# EAGLE design Adafruit BNO055 (EAGLE 6.6.0)
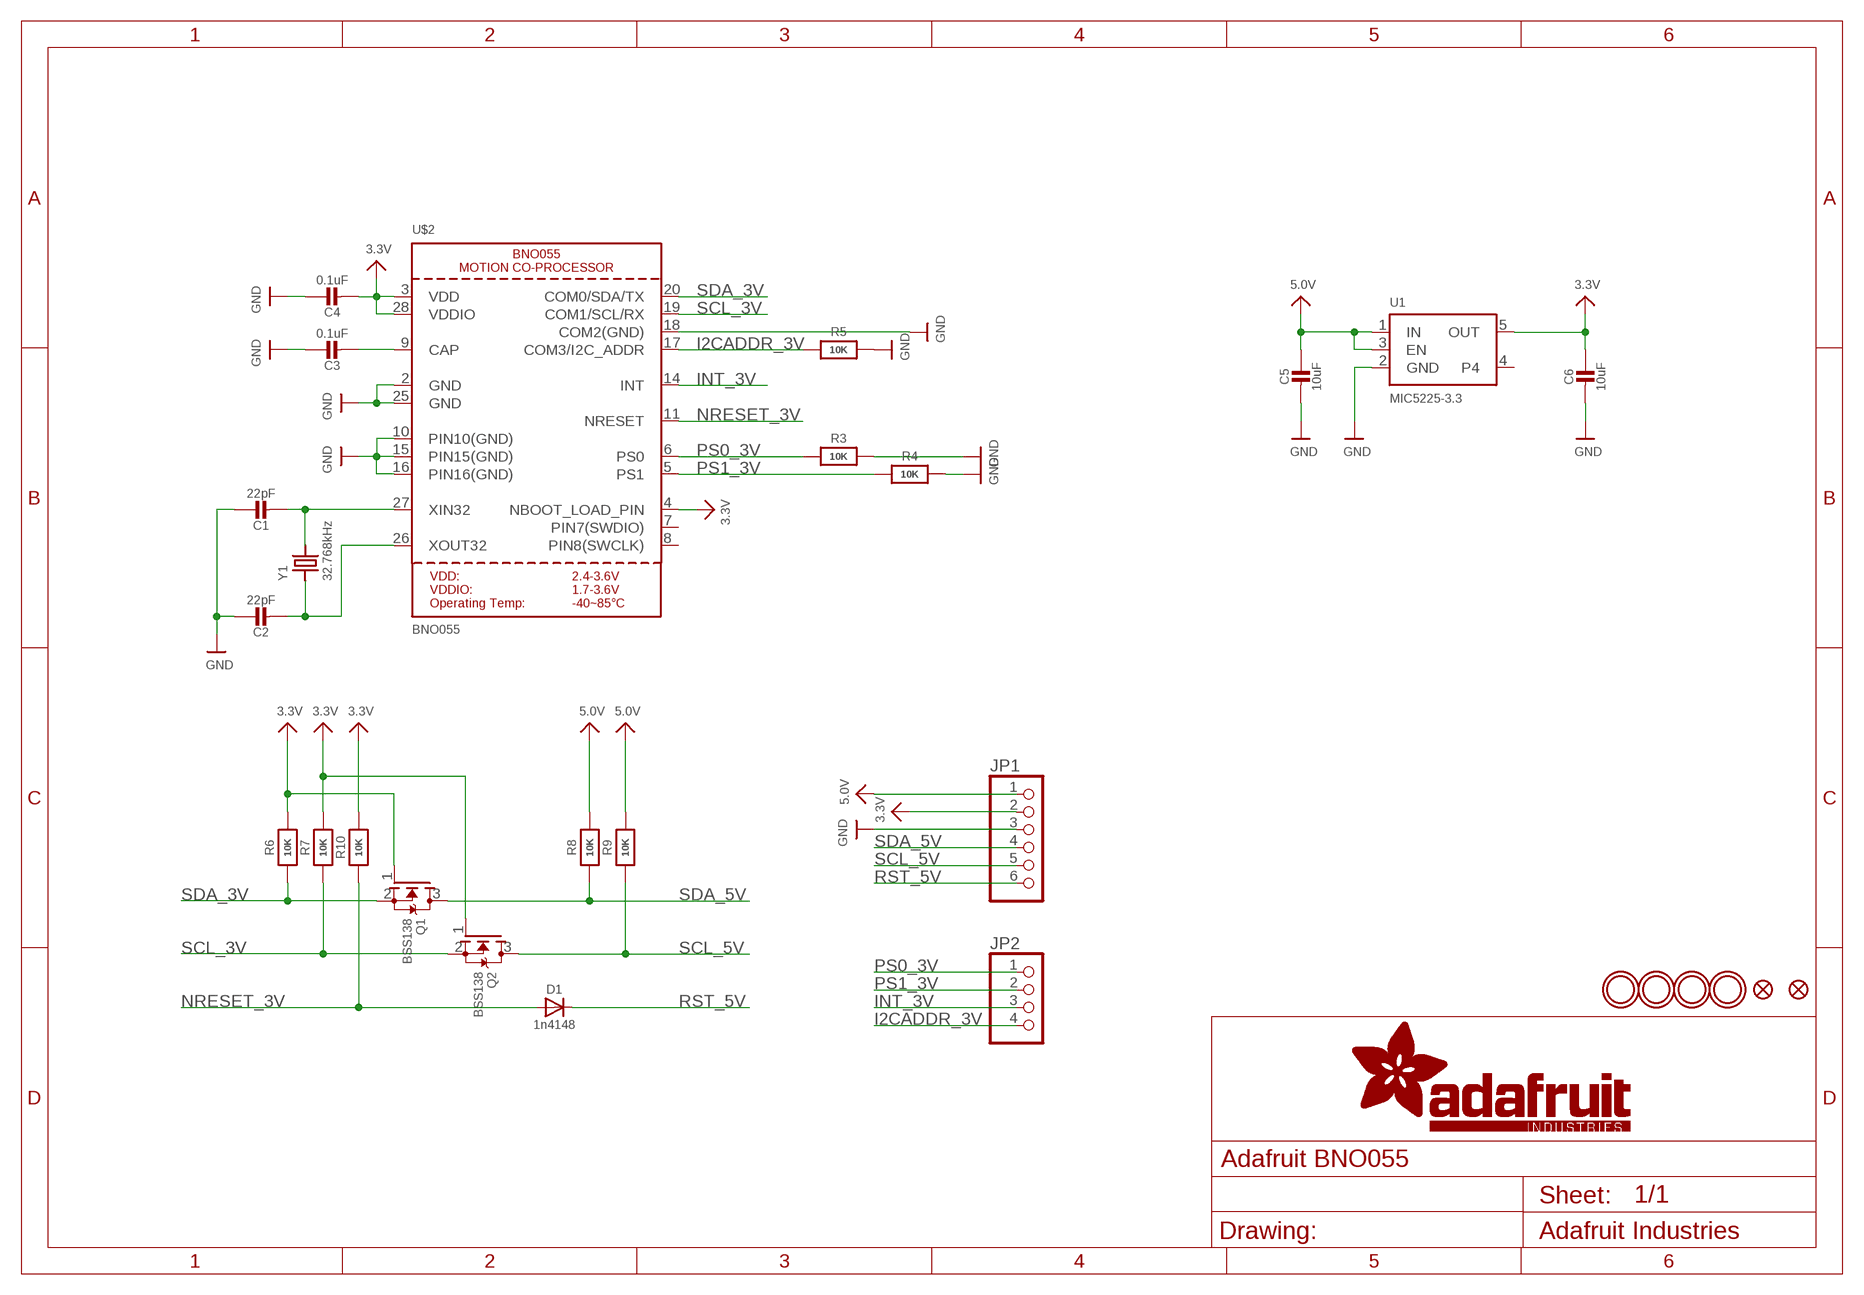
[diagram p0: schematic, sheet 1]

## Parts
C1  22pF  CAP_CERAMIC0805-NOOUTLINE  [0805-NO]
C2  22pF  CAP_CERAMIC0805-NOOUTLINE  [0805-NO]
C3  0.1uF  CAP_CERAMIC0805-NOOUTLINE  [0805-NO]
C4  0.1uF  CAP_CERAMIC0805_10MGAP  [0805_10MGAP]
C5  10uF  CAP_CERAMIC0805-NOOUTLINE  [0805-NO]
C6  10uF  CAP_CERAMIC0805_10MGAP  [0805_10MGAP]
D1  1n4148  DIODESOD-323  [SOD-323]
FID1  FIDUCIAL""  [FIDUCIAL_1MM]
FID2  FIDUCIAL""  [FIDUCIAL_1MM]
JP1  HEADER-1X676MIL  [1X06_ROUND_76]
JP2  HEADER-1X476MIL  [1X04_ROUND_76]
Q1  BSS138  MOSFET-NWIDE  [SOT23-WIDE]
Q2  BSS138  MOSFET-NWIDE  [SOT23-WIDE]
R3  10K  RESISTOR0805_NOOUTLINE  [0805-NO]
R4  10K  RESISTOR0805_NOOUTLINE  [0805-NO]
R5  10K  RESISTOR0805_NOOUTLINE  [0805-NO]
R6  10K  RESISTOR0805_NOOUTLINE  [0805-NO]
R7  10K  RESISTOR0805_NOOUTLINE  [0805-NO]
R8  10K  RESISTOR_0805MP  [_0805MP]
R9  10K  RESISTOR_0805MP  [_0805MP]
R10  10K  RESISTOR0805_NOOUTLINE  [0805-NO]
U1  MIC5225-3.3  VREG_SOT23-5  [SOT23-5]
U$2  BNO055  [BNO055]
U$29  MOUNTINGHOLE2.5_THICK  [MOUNTINGHOLE_2.5_PLATED_THICK]
U$30  MOUNTINGHOLE2.5_THICK  [MOUNTINGHOLE_2.5_PLATED_THICK]
U$31  MOUNTINGHOLE2.5_THICK  [MOUNTINGHOLE_2.5_PLATED_THICK]
U$32  MOUNTINGHOLE2.5_THICK  [MOUNTINGHOLE_2.5_PLATED_THICK]
Y1  32.768kHz  CRYSTAL8.0X3.8  [CRYSTAL_8X3.8]

## Nets
3.3V: C4.2 C6.1 JP1.2 Q1.1(G) Q2.1(G) R6.2 R7.2 R10.2 U1.5(OUT) U$2.3(VDD) U$2.4(NBOOT_LOAD_PIN) U$2.28(VDDIO)
5.0V: C5.1 JP1.1 R8.2 R9.2 U1.1(IN) U1.3(EN)
GND: C1.1 C2.1 C3.1 C4.1 C5.2 C6.2 JP1.3 R3.2 R4.2 R5.2 U1.2(GND) U$2.2(GND) U$2.10(PIN10(GND)) U$2.15(PIN15(GND)) U$2.16(PIN16(GND)) U$2.18(COM2(GND)) U$2.25(GND)
I2CADDR_3V: JP2.4 R5.1 U$2.17(COM3/I2C_ADDR)
INT_3V: JP2.3 U$2.14(INT)
N$1: C1.2 U$2.27(XIN32) Y1.P$4
N$2: C2.2 U$2.26(XOUT32) Y1.P$1
N$3: C3.2 U$2.9(CAP)
NRESET_3V: D1.A R10.1 U$2.11(NRESET)
PS0_3V: JP2.1 R3.1 U$2.6(PS0)
PS1_3V: JP2.2 R4.1 U$2.5(PS1)
RST_5V: D1.C JP1.6
SCL_3V: Q2.2(S) R7.1 U$2.19(COM1/SCL/RX)
SCL_5V: JP1.5 Q2.3(D) R9.1
SDA_3V: Q1.2(S) R6.1 U$2.20(COM0/SDA/TX)
SDA_5V: JP1.4 Q1.3(D) R8.1
Unconnected: U1.4 U$2.7(PIN7(SWDIO)) U$2.8(PIN8(SWCLK))

## Library data of the parts
C1-C6 = microbuilder:CAP_CERAMIC: Ceramic Capacitors For new designs, use the packages preceded by an '_' character since they are more reliable: The following footprints should be used on most boards: _0402 - Standard footprint for regular board layouts _0603 - Standard footprint for regular board layouts _0805 - Standard footprint for regular board layouts _1206 - Standard footprint for regular board layouts For extremely tight-pitch boards where space is at a premium, the following 'micro-pitch' footprints can be used (smaller pads, no silkscreen outline, etc.): _0402MP - Micro-pitch footprint for very dense/compact boards _0603MP - Micro-pitch footprint for very dense/compact boards _0805MP - Micro-pitch footprint for very dense/compact boards _1206MP - Micro-pitch footprint for very dense/compact boards
D1 = microbuilder:DIODE: Diode SMA Model Volts Amps Type Vf Ir Digikey # Notes SSA34-E3 40V 3A Schottky 480mV @ 3A 200uA @ 40V SSA34-E3/61TGITR-ND CDBA120-G 20V 1A Schottky 500mV @ 1A 500uA @ 20V 641-1014-6-ND REEL MBRA210 10V 2A Schottky 350mV @ 2A 700uA @ 10V MBRA210LT3 SOD-123 Model Volts Amps Type Vf Ir Order # Notes BAT54T1G 30V 200mA Schottky 800mV @ 200mA 2uA @ 25V BAT54T1GOSTR-ND B0530W 30V 500mA Schottky 430mV @ 500mA 130uA @ 30V B0530W-FDICT-ND REEL MBR120 20V 1A Schottky 340mV @ 1A MBR120VLSFT1GOSCT-ND SOD-323 Model Volts Amps Type Vf Ir Order # Notes PMEG2005EJ 20V 500mA Schottky 355mV @ 500mA 568-4110-1-ND ZLLS410 10V 570mA Schottky 380mV @ 570mA ZLLS410CT-ND 1N4148WS 75V 150mA Silicon/Simple 1V 1N4148WSFSCT-ND REEL SOD-523 Model Volts Amps Type Vf Ir Order # Notes BAT54XV2 30V 200mA Schottky 0.8V @ 100mA BAT54XV2CT-ND TB751S 30V 30mA Schottky RB751S-40TE61CT-ND SOT23-R/W (R = Solder Paste/Reflow Ovens, W = Hand-Soldering) Model Volts Amps Type Vf Ir Order # Notes BAT54FILM 40V 300mA Schottky 497-7162-1-ND POWERDI-5 Model Volts Amps Type Vf Ir Order # Notes PDS560 60V 5A Schottky 670mV @ 5A 150uA @ 60V PDS560DICT-ND
FID1 FID2 = microbuilder:FIDUCIAL: Fiducial Alignment Points Various fiducial points for machine vision alignment.; BOM: EXCLUDE
JP1 = microbuilder:HEADER-1X6: PIN HEADER
JP2 = microbuilder:HEADER-1X4: PIN HEADER
Q1 Q2 = microbuilder:MOSFET-N: N-Channel Mosfet LEGEND VDS: Voltage Drain-Source ID: Drain Current RDS(ON): Drain-Source On-State Resistance VGS(TH): Gate-Source Threshold Voltage CISS: Drain-Source Input Capacitance SOT-23 Name VDS ID RDS(ON) VGS(TH) CISS Order Number 2N7002E 60V 260mA 2.5 Ohm 2.5V @ 250uA 26.7pF @ 25V 2N7002ET1GOSTR-ND BSH103 30V 850mA 400 mOhm 400mV @ 1mA 83pF @ 24V BSH103,235-ND BSS138 60V 320mA 1.6 Ohm 1.5V @ 250uA 50pF @ 10V Mouser: 771-BSS138PW115 DMN2075U-7 20V 4.2A 38 mOhm 1V @ 250 uA 594.3pF @ 10V DMN2075U-7DICT-ND * BSS138 good choice for I2C level-shifting POWERPAK 1212-8 Name VDS ID RDS(ON) VGS(TH) CISS Order Number Si7308DN 60V 6A 58 mOhm 3V @ 250uA 665pF @ 15V SI7308DN-T1-E3CT-ND
R3-R10 = microbuilder:RESISTOR: Resistors For new designs, use the packages preceded by an '_' character since they are more reliable: The following footprints should be used on most boards: _0402 - Standard footprint for regular board layouts _0603 - Standard footprint for regular board layouts _0805 - Standard footprint for regular board layouts _1206 - Standard footprint for regular board layouts For extremely tight-pitch boards where space is at a premium, the following 'micro-pitch' footprints can be used (smaller pads, no silkscreen outline, etc.): _0402MP - Micro-pitch footprint for very dense/compact boards _0603MP - Micro-pitch footprint for very dense/compact boards _0805MP - Micro-pitch footprint for very dense/compact boards _1206MP - Micro-pitch footprint for very dense/compact boards
U1 = microbuilder:VREG_SOT23-5: SOT23-5 Fixed Voltage Regulators Part Current Out V Out V In V Dropout θJA (°C/W) TJ (°C) Digikey Part No. ADP121 150mA 3.3V 3.4-5.5V 0.09V @ 150mA -- -- ADP121-AUJZ33R7CT-ND ADP121 150mA 3.0V 3.1-5.5V 0.09V @ 150mA -- -- ADP121-AUJZ30R7CT-ND ADP122 300mA 3.3V 3.4-5.5V 0.085V @ 300mA -- -- ADP122AUJZ-3.3-R7CT-ND ADP1712 300mA 3.3V 3.5-5.5V 0.17V @ 300mA -- -- ADP1712AUJZ-3.3-R7TR-ND AP7311 (Low Cost) 150mA 3.3V 3.5-6V 0.15V @ 150mA -- -- AP7311-33WG-7DICT-ND LD39015M18R 150mA 1.8V 1.9V-5.5V 0.08V @ 100mA -- -- 497-6977-1-ND LP2985A-33DBVR 150mA 3.3V 3.3-16V 0.28V @ 150mA 206 150 296-18479-1-ND MCP1824T-3302E/OT 300mA 3.3V 3.5V-6V 0.2V @ 300mA -- -- MCP1824T-3302E/OTCT-ND MIC5205-2.5YM5 TR 150mA 2.5V 2.7-16V 0.165V @ 150mA -- -- 576-1257-2-ND MIC5205-3.0YM5 TR 150mA 3.0V 3.2V-16V 0.165V @ 150mA -- -- 576-1258-2-ND MIC5205-3.3YM5 TR 150mA 3.3V 3.5V-16V 0.165V @ 150mA -- -- 576-1259-2-ND TPS780330220 150mA 3.3V+2.2V 3.6-5.5V 250mV Max -- -- 296-23332-1-ND TDA3663/N1,135 100mA 3.3V 3.5-45V 0.18V @ 50mA -- -- 568-5343-1-ND Max operating temp can be calculated using θJA, TJ (max junction temperature), and power in watts. Set the "Maximum Ambient Temperature" until it reaches TJ ("Max Junction Temperature"), which is the absolute limit for safe use of the regulator: Heat Sink Temperature Calculator <http://www.daycounter.com/Calculators/Heat-Sink-Temperature-Calculator.phtml> For example, With 12V source into a 3.3V LP2985 and a 30mA load, we are dissipating (12V-3.3V) * 0.03A = 0.261W. With a θJA of 206 °C/W, a TJ of 150°C, and 261mW we can safely use the chip without a heat sink up to 75°C (=147.1°C Junction Temperature).
U$2 = microbuilder:BNO055: BNO055 - Motion Co-Processor
U$29-U$32 = microbuilder:MOUNTINGHOLE: Mounting Hole For #2 screws (0.086"/2.18mm width, 0.094"/2.4mm hole) use 2.5mm; BOM: EXCLUDE
Y1 = microbuilder:CRYSTAL: Crystals HC49UP - Surface Mount Crystal 4.0MHz 18pF +/-30ppm Surface Mount Crystal [Digikey: 535-9857-1-ND] 12.0 MHz Surface Mount Crystal [Digikey: 535-9869-6-ND] 25.0 MHz Surface Mount Crystal [Digikey: 535-9078-1-ND] 2.5 x 2.0mm - MEMs SMT Crystal 16.0 MHz 10pF 20ppm 2.5 x 2.0mm Crystal [Digikey -40-85°C: 535-10923-1-ND] 3.2 x 2.5mm - MEMs SMT Crystal 12.0 MHz 8pF 15ppm 3.2 x 2.5mm Crystal [Digikey: -10-70°C: 644-1047-1-ND -40-125°C: 644-1128-1-ND] 40~85°C cheaper: 644-1173-6-ND 16.0 MHz 8pF 15ppm 3.2 x 2.5mm Crystal [Digikey: -10-70°C: 644-1049-1-ND -40-125°C: 644-1129-2-ND]-40~85°C cheaper: 644-1175-6-ND 16.0 MHz 10pF 10ppm 3.2 x 2.5mm Crystal [Digikey: 644-1100-1-ND] 27.12 MHz 18pF 30ppm 3.2 x 2.5mm Crystal [Digikey: 887-1424-1-ND] 27.12MHz 10pF 10ppm 3.2 x 2.5mm Crystal [Digikey: 887-1329-1-ND] 4.9 x 1.8mm - MEMs SMT Crystal 32.768 KHz 12.5pF 20ppm 4.9 x 1.8mm Crystal [Digikey: SE2415CT-ND] 8.0 x 3.8mm - Surface Mount Crystal 32.768kHz 12.5pF 20ppm -40°C-85°C [Digikey: 535-9166-2-ND] Cylinder 32.768KHz Cylinder Crystal (2x6mm body) [Ex. Digikey: 300-8341-2-ND]

## Board
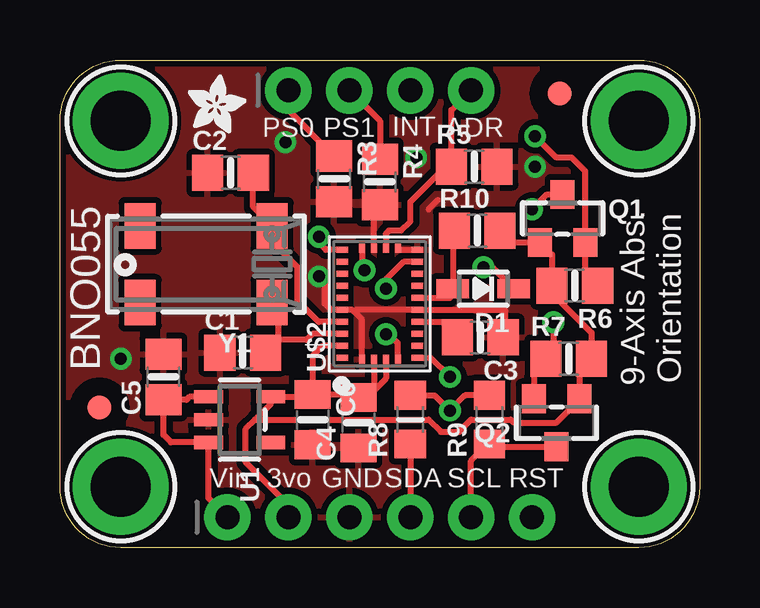
[diagram p1: board, top side]
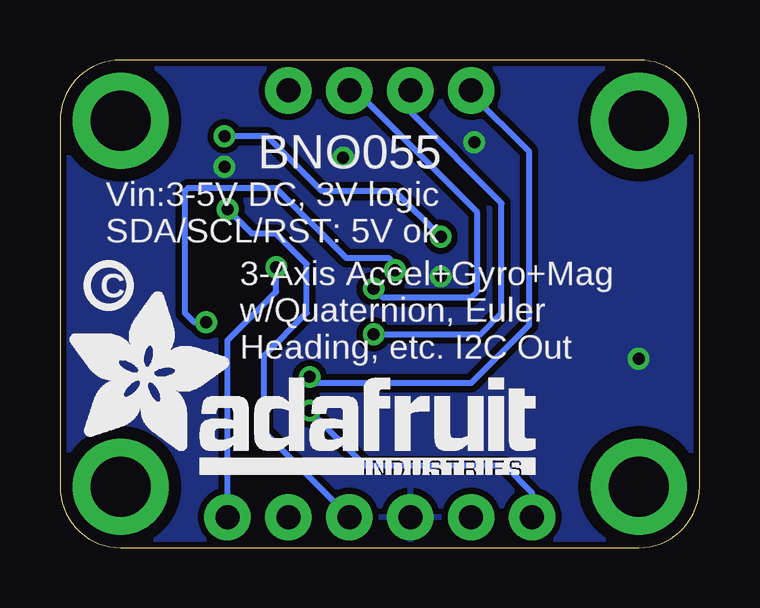
[diagram p2: board, bottom side, seen from below]

Size 26.67 x 20.32 mm. Coordinates in mm from the lower left corner, seen from the top.
Outline: 2.54,20.32 24.13,20.32 arc-90 26.67,17.78 26.67,2.54 arc-90 24.13,0 2.54,0 arc-90 0,2.54 0,17.78 arc-90 2.54,20.32
Copper layers (1*16): Top 0.035mm / dielectric 1.5mm / Bottom 0.035mm
Design rules "adafruit *": minimum track width 8mil, minimum drill 15.5mil, track to track 8mil, track to pad 8mil, pad to pad 8mil, via to via 8mil, smd to smd 8mil, copper to edge 10mil, drill to drill 8mil, minimum pad ring 10mil, minimum via ring 8mil, stop-mask expansion 2mil, vias tented up to drill 20mil, thermal gap 10mil

### Footprints (pad centres in the part's own frame; a part is rotated, then mirrored left to right if it is on the bottom)
0805-NO = smd 1.3 x 1.5: 1 -0.95,0; 2 0.95,0
0805_10MGAP = smd 1.2 x 1.5: 1 -1.05,0; 2 1.05,0
SOD-323 = smd 1.35 x 0.8: A 1.27,0; C -1.27,0
FIDUCIAL_1MM = smd 1 x 1: 1 0,0
1X06_ROUND_76 = drill 1 pad 1.93: 1 -6.35,0; 2 -3.81,0; 3 -1.27,0; 4 1.27,0; 5 3.81,0; 6 6.35,0
1X04_ROUND_76 = drill 1 pad 1.93: 1 -3.81,0; 2 -1.27,0; 3 1.27,0; 4 3.81,0
SOT23-WIDE = smd 1 x 1.2: 1 -0.95,-1; 2 0.95,-1; 3 0,1
_0805MP = smd 1.2 x 1.3: 1 -1.016,0; 2 1.016,0
SOT23-5 = smd 0.55 x 1.2: 1 -0.95,-1.3; 2 0,-1.3; 3 0.95,-1.3; 4 0.95,1.3; 5 -0.95,1.3
BNO055 = smd 0.25 x 0.475: 1 -2.25,1.562; 6 -2.25,-1.562; 7 -1.75,-1.562; 8 -1.25,-1.562; 9 -0.75,-1.562; 10 -0.25,-1.562; 11 0.25,-1.562; 12 0.75,-1.562; 13 1.25,-1.562; 14 1.75,-1.562; 15 2.25,-1.562; 20 2.25,1.562; 21 1.75,1.562; 22 1.25,1.562; 23 0.75,1.562; 24 0.25,1.562; 25 -0.25,1.562; 26 -0.75,1.562; 27 -1.25,1.562; 28 -1.75,1.562 | smd 0.375 x 0.25: 2 -2.312,0.75; 3 -2.312,0.25; 4 -2.312,-0.25; 5 -2.312,-0.75; 16 2.312,-0.75; 17 2.312,-0.25; 18 2.312,0.25; 19 2.312,0.75
MOUNTINGHOLE_2.5_PLATED_THICK = drill 2.5 pad 4: P$1 0,0
CRYSTAL_8X3.8 = smd 1.3 x 1.9: P$1 -2.75,-1.6; P$2 2.75,-1.6; P$3 2.75,1.6; P$4 -2.75,1.6

### Placement (x,y rotation side)
C1  7.62,8.13 0 top
C2  7.11,15.62 0 top
C3  17.53,8.76 180 top
C4  12.45,5.21 90 top
C5  4.32,7.11 90 top
C6  10.54,5.33 270 top
D1  17.65,10.79 180 top
FID1  20.83,18.92 0 top
FID2  1.65,5.84 0 top
JP1  13.34,1.27 0 top
JP2  13.34,19.05 0 top
Q1  20.95,13.72 0 top
Q2  20.7,5.21 180 top
R3  11.43,15.37 270 top
R4  13.34,15.24 270 top
R5  17.27,15.88 0 top
R6  21.46,10.92 180 top
R7  21.21,7.87 0 top
R8  14.61,5.33 90 top
R9  17.91,5.33 90 top
R10  17.4,13.21 0 top
U1  7.49,5.33 270 top
U$2  13.34,10.16 90 top
U$3  [PCBFEAT-REV-040]  24.64,10.92 0 bottom
U$28  [ADAFRUIT_TEXT_20MM]  26.42,3.05 0 bottom
U$29  2.54,17.78 0 top
U$30  2.54,2.54 0 top
U$31  24.13,17.78 0 top
U$32  24.13,2.54 0 top
U$33  [ADAFRUIT_2.5MM]  5.33,17.27 0 top
Y1  6.1,11.81 180 top

### Tracks (layer width: path | path; a pad name or v marks a point on that pad's centre or on a via)
3.3V
  Top 0.254: U$2.3 13.09,6.55 | U$2.4 13.59,7.05 13.09,6.55 | U$2.28 10.95,8.41 10.54,8 C6.1 | 22.03,7.75 R7.2 | JP1.2 9.53,1.78 7.75,3.56 7.75,4.95 8.13,5.33 | 8.13,5.33 8.79,6 U1.5 10.44,6.28 C6.1 | 8.13,5.33 15.37,5.33 15.88,4.83 16.64,4.83 17.14,5.33 18.8,5.33 18.92,5.21 20.7,5.21 21.65,6.16 Q2.1 21.65,7.37 R7.2 | R10.2 18.84,12.72 Q1.1 20.51,12.21 R6.2 20.51,10.6 22.16,8.96 R7.2 | C6.1 12.32,6.38 C4.2 12.8,6.26 13.09,6.55
5.0V  (via drill 0.5)
  Top 0.254: JP1.1 6.19,2.06 U1.3 4.63,4.38 4.32,4.7 C5.1 5.27,6.16 5.39,6.28 U1.1 | R8.2 15.62,6.35 v16.26,5.71 16.89,6.35 R9.2
  Bottom 0.254: v16.26,5.71 13.97,3.43 8.13,3.43 6.99,2.29 JP1.1
GND  (via drill 0.5)
  Top 0.254: U$2.2 12.59,9.51 12.26,9.84 | 12.26,9.84 12.19,9.91 U$2.25 11.3,9.91 11.05,10.16 11.05,11.18 | U$2.18 13.09,14.04 R4.2 | U$2.16 14.15,12.41 U$2.15 | C3.1 18.54,8.83 18.54,9.91 U$2.10 12.32,9.91 12.26,9.84 | 15.37,14.1 15.75,14.48 | 17.91,15.88 R5.2
  Bottom 0.254: 10.92,11.56 10.79,11.68
  other vias: 2.54,7.87 9.4,16.89 19.81,15.88 10.79,11.3 14.86,16.26
  pour Bottom (isolate 0.254): 0,20.32 26.67,20.32 26.67,0 0,0
  pour Top (isolate 0.254): 0,20.32 26.67,20.32 26.67,0 0,0
I2CADDR_3V
  Top 0.254: U$2.17 13.59,13.08 13.72,13.21 14.22,13.21 14.61,13.59 14.61,14.41 16.07,15.88 R5.1 16.32,18.23 JP2.4
INT_3V  (via drill 0.5)
  Top 0.254: U$2.14 14.32,11.91 13.59,11.18 v13.59,10.79
  Bottom 0.254: v13.59,10.79 13.21,10.41 9.53,10.41 9.27,10.67 9.27,13.97 14.35,19.05 JP2.3
N$1
  Top 0.254: U$2.27 10.53,8.91 10.28,8.66 9.1,8.66 | 9.1,8.66 C1.2 | Y1.P$4 9.1,9.96 9.1,8.66
N$2
  Top 0.254: U$2.26 10.78,9.41 9.91,10.29 9.91,11.68 8.85,12.74 Y1.P$1 8.06,14.2 C2.2
N$3
  Top 0.254: U$2.9 15.93,9.41 C3.2
NRESET_3V
  Top 0.254: U$2.11 16.25,10.41 16.38,10.54 D1.A 16.38,13.27 R10.1
PS0_3V  (via drill 0.5)
  Top 0.254: JP2.1 9.53,18.22 R3.1 | U$2.6 15.46,7.91 v16.26,7.11
  Bottom 0.254: JP2.1 9.53,18.92 7.11,16.51 7.11,9.27 9.53,6.86 16,6.86 v16.26,7.11
PS1_3V  (via drill 0.5)
  Top 0.254: JP2.2 13.34,17.78 R4.1 | U$2.5 14.09,8.52 13.72,8.89 v13.59,8.89
  Bottom 0.254: v13.59,8.89 9.14,8.89 8.26,9.78 8.26,14.35 12.06,18.16 JP2.2
RST_5V  (via drill 0.5)
  Top 0.254: D1.C 18.03,11.68 v17.65,11.68
  Bottom 0.254: JP1.6 19.68,8.64 17.65,10.67 v17.65,11.68
SCL_3V  (via drill 0.5)
  Top 0.254: U$2.19 12.59,11.67 v12.7,11.56 | v20.57,9.4 20.57,7.94 20.51,7.87 R7.1 19.75,7.37 Q2.2
  Bottom 0.254: v12.7,11.56 12.7,11.81 12.95,12.06 14.73,12.06 17.65,14.99 21.34,14.99 21.46,14.86 21.46,9.78 21.08,9.4 v20.57,9.4
SCL_5V
  Top 0.254: JP1.5 17.14,3.62 17.84,4.32 R9.1 18.02,4.21 Q2.3
SDA_3V  (via drill 0.5)
  Top 0.254: U$2.20 11.09,12.41 10.79,12.7 v10.79,12.95 | R6.1 21.91,11.43 Q1.2 21.91,15.69 21.34,16.26 20.7,16.26 v19.81,17.14
  Bottom 0.254: v10.79,12.95 12.7,14.86 15.75,14.86 18.03,17.14 v19.81,17.14
SDA_5V  (via drill 0.5)
  Top 0.254: R8.1 JP1.4 | v19.68,14.1 20.3,14.72 Q1.3
  Bottom 0.254: JP1.4 18.16,4.83 18.16,8 16.38,9.78 16.38,11.81 17.65,13.08 18.67,13.08 v19.68,14.1

### Text on the board
tPlace: PS0 | PS1 | INT | ADR | BNO055 | 9-Axis Abs. / Orientation | Vin | 3vo | GND | SDA | SCL | RST
bPlace: BNO055 | Vin:3-5V DC, 3V logic / SDA/SCL/RST: 5V ok | 3-Axis Accel+Gyro+Mag / w/Quaternion, Euler / Heading, etc. I2C Out